# EAGLE design Diff_PressureSensor_SDP_v1.1_mrt2022 (EAGLE 9.6.2)
COMPANY: Adafruit Industries; DRAWN: KTOWN; REV: A
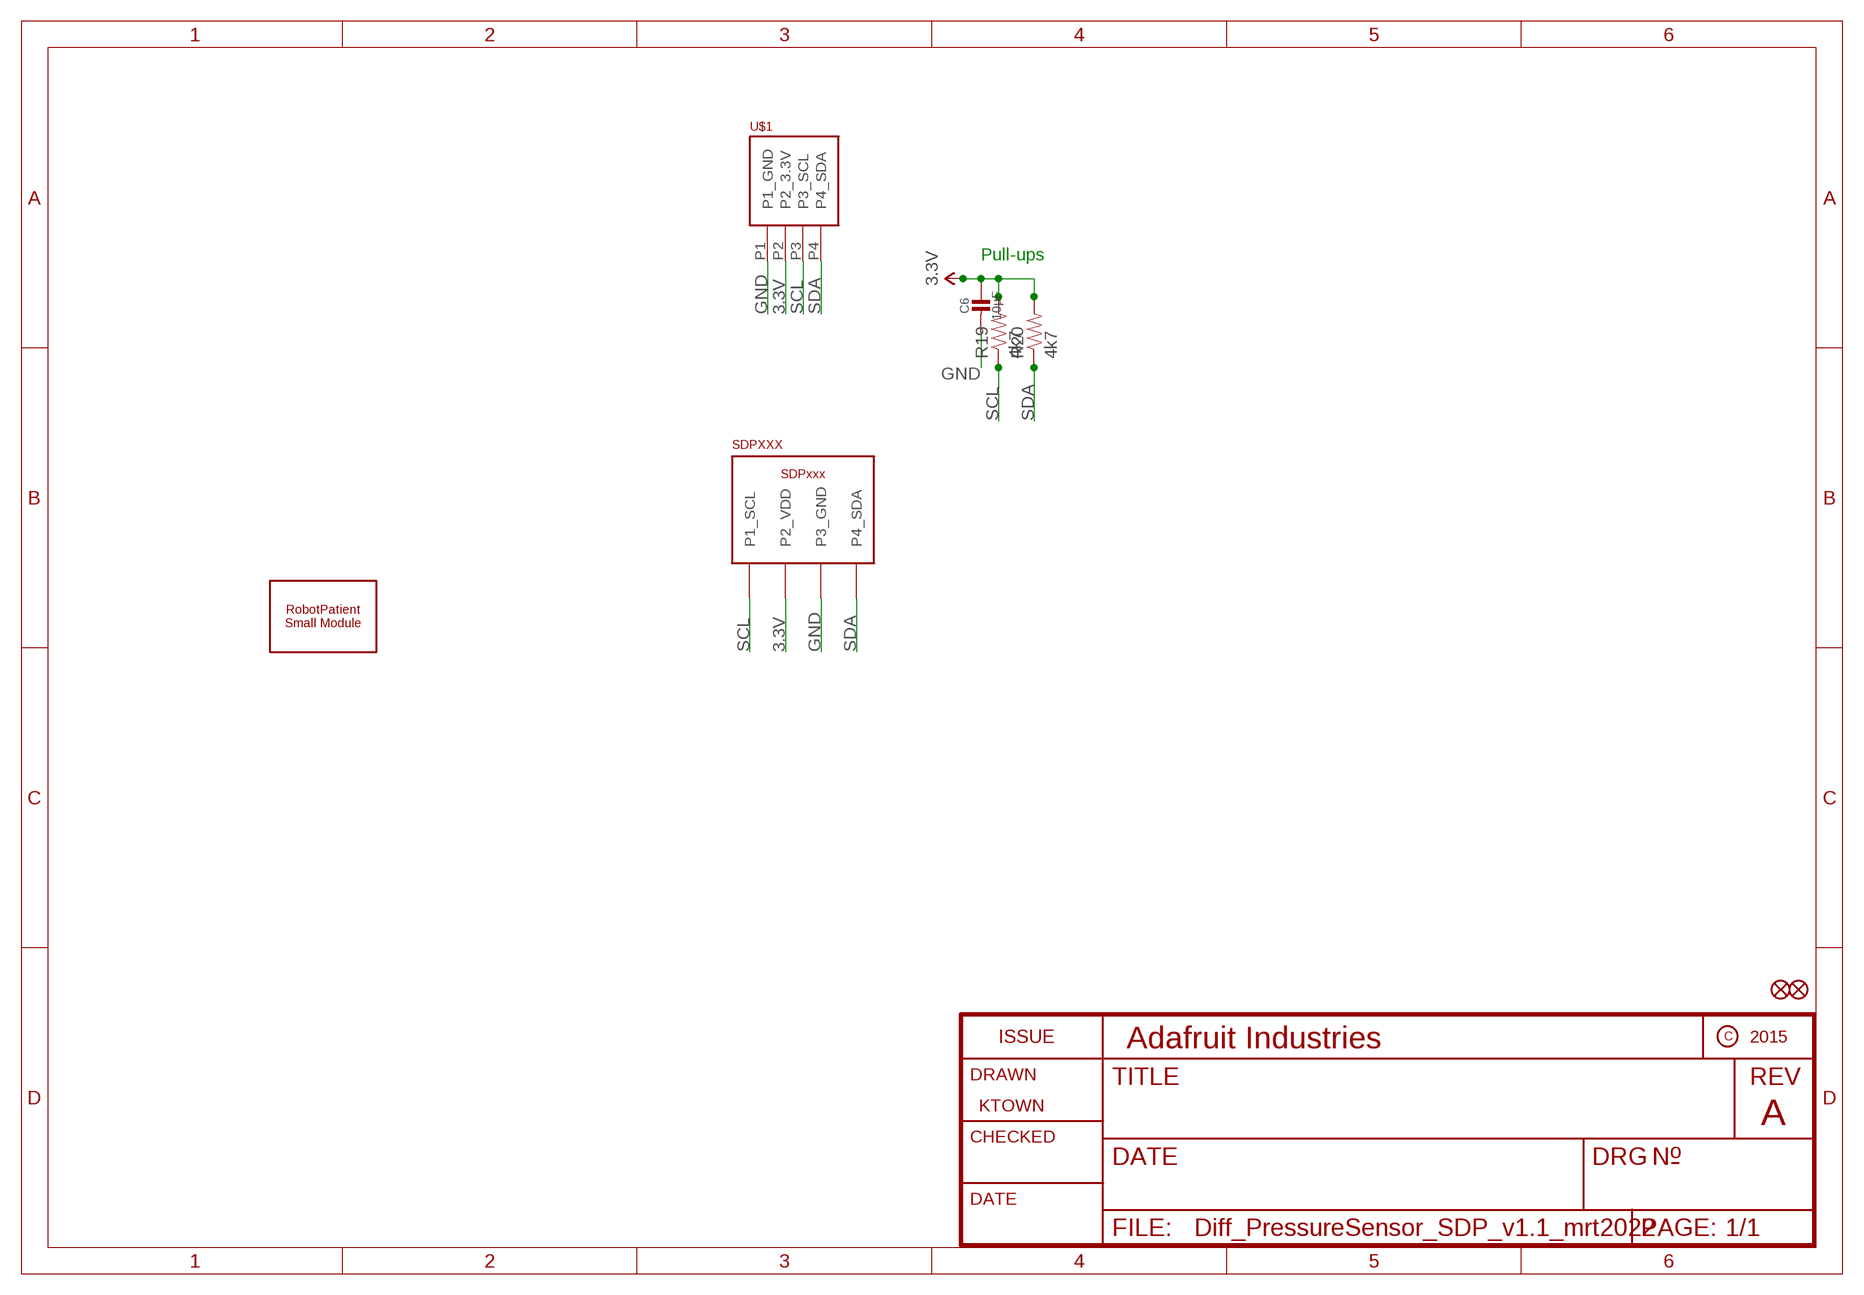
[diagram p0: schematic, sheet 1]

## Parts
C6  10µF  CAP_CERAMIC0805-NOOUTLINE  [0805-NO]
FID1  FIDUCIAL""  [FIDUCIAL_1MM]
FID2  FIDUCIAL""  [FIDUCIAL_1MM]
R19  4k7  47KOHM1/10W1%(0603)  [0603-RES]
R20  4k7  47KOHM1/10W1%(0603)  [0603-RES]
SDP810  SDPXXX  [SDPXXX]
U$1  PHOENIX_PTSM_M4_THANGLE  [PTSM_M4_TH]
U$2  ROBOTPATIENT_SMALL_MODULEBOARD  [RP_SMALL_SENSOR_OUTLINE]

## Nets
3.3V: C6.1 R19.2 R20.2 SDP810.P3_VCC(P2_VDD) U$1.P2(P2_3.3V)
GND: C6.2 SDP810.P2_GND(P3_GND) U$1.P1(P1_GND)
SCL: R19.1 SDP810.P4_CLK(P1_SCL) U$1.P3(P3_SCL)
SDA: R20.1 SDP810.P1_SDA(P4_SDA) U$1.P4(P4_SDA)

## Notes on the sheet
- Pull-ups

## Library data of the parts
C6 = microbuilder:CAP_CERAMIC: Ceramic Capacitors For new designs, use the packages preceded by an '_' character since they are more reliable: The following footprints should be used on most boards: _0402 - Standard footprint for regular board layouts _0603 - Standard footprint for regular board layouts _0805 - Standard footprint for regular board layouts _1206 - Standard footprint for regular board layouts For extremely tight-pitch boards where space is at a premium, the following 'micro-pitch' footprints can be used (smaller pads, no silkscreen outline, etc.): _0402MP - Micro-pitch footprint for very dense/compact boards _0603MP - Micro-pitch footprint for very dense/compact boards _0805MP - Micro-pitch footprint for very dense/compact boards _1206MP - Micro-pitch footprint for very dense/compact boards
FID1 FID2 = microbuilder:FIDUCIAL: Fiducial Alignment Points Various fiducial points for machine vision alignment.; BOM: EXCLUDE
R19 R20 = SparkFun-Resistors:47KOHM1/10W1%(0603): RES-07871; PROD_ID: RES-07871; VALUE: 47K
SDP810 = jk_customs:SDPXXX: Sensirion SDPxxx (e.g. SDP81x) March 2022
U$1 = jk_customs:PHOENIX_PTSM_M4_TH
U$2 = jk_customs:ROBOTPATIENT_SMALL_MODULE

## Net classes
1 power: width 0.305 mm
2 gnd: width 0.254 mm

## Board
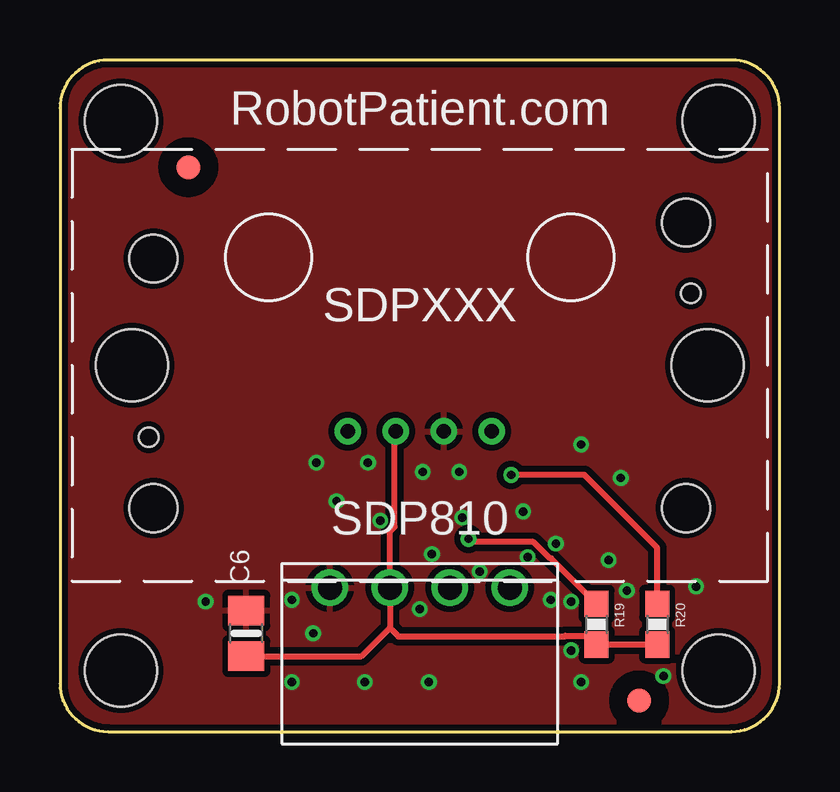
[diagram p1: board, top side]
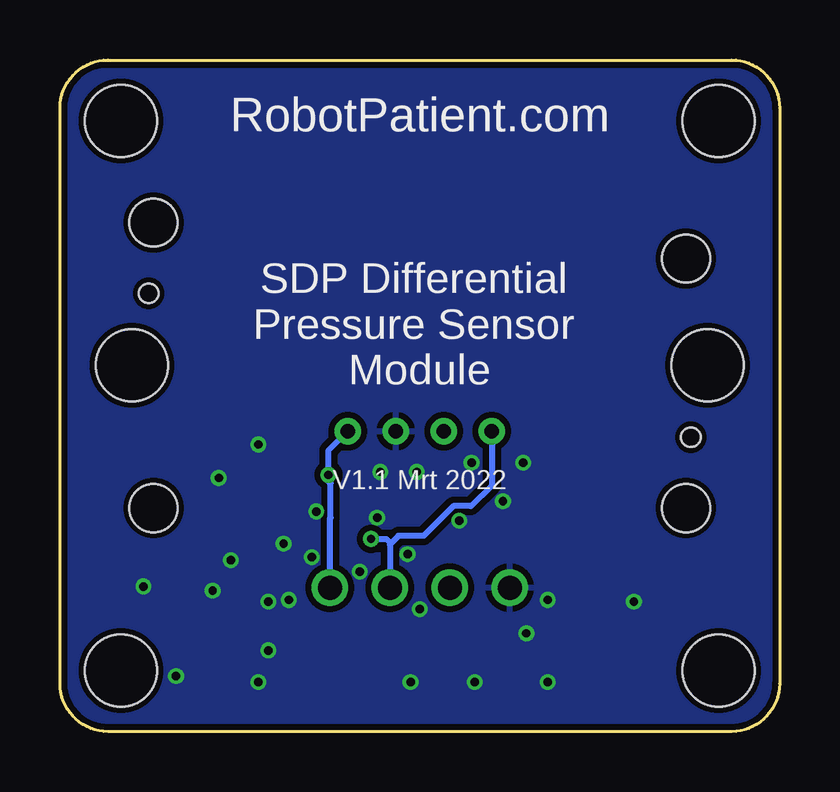
[diagram p2: board, bottom side, seen from below]

Size 30 x 28 mm. Coordinates in mm from the lower left corner, seen from the top.
Copper layers (1*16): Top 0.035mm / dielectric 1.5mm / Bottom 0.035mm
Design rules "SeeedStudio_2layer_DRU_no_angle_20140221": minimum track width 6mil, minimum drill 12mil, track to track 6mil, track to pad 6mil, pad to pad 6mil, via to via 6mil, smd to smd 0mil, copper to edge 10mil, drill to drill 10mil, minimum pad ring 10mil, minimum via ring 6mil, stop-mask expansion 2mil, vias tented up to drill 100mil, thermal gap 10mil

### Footprints (pad centres in the part's own frame; a part is rotated, then mirrored left to right if it is on the bottom)
0805-NO = smd 1.24 x 1.5: 1 -0.95,0; 2 0.95,0
FIDUCIAL_1MM = smd 1 x 1: 1 0,0
0603-RES = smd 1.1 x 1: 1 -0.85,0; 2 0.85,0
SDPXXX = drill 0.6: P1_SDA 3,-2.75; P2_GND 1,-2.75; P3_VCC -1,-2.75; P4_CLK -3,-2.75 | hole 3: 12,0; -12,0 | hole 2: 11.1,5.95; 11.1,-5.95; -11.1,4.45; -11.1,-5.95 | hole 0.8: -11.3,-3; 11.3,3
PTSM_M4_TH = drill 1: P1 3.75,1; P2 1.25,1; P3 -1.25,1; P4 -3.75,1
RP_SMALL_SENSOR_OUTLINE = hole 3: -11.455,12.455; 11.455,12.455; 11.455,-12.455; -11.455,-12.455

### Placement (x,y rotation side)
C6  7.76,4.09 90 top
FID1  5.35,23.53 0 top
FID2  24.14,1.3 0 top
R19  22.37,4.47 270 top
R20  24.91,4.47 270 top
SDP810  15,15.27 0 top
U$1  15,7 180 top
U$2  15,14 90 top

### Tracks (layer width: path | path; a pad name or v marks a point on that pad's centre or on a via)
3.3V
  Top 0.254: SDP810.P3_VCC 13.96,12.48 13.96,8.54 13.75,8.34 U$1.P2 13.75,4.33 | 13.75,4.33 14.11,3.97 21.04,3.97 21.06,3.99 22,3.99 R19.2 R20.2 | 13.75,4.33 12.57,3.14 C6.1
GND  (via drill 0.35)
  other vias: 16.65,10.82 13.35,8.79 9.67,5.49 9.67,2.06 16.78,8.92 19.32,9.17 21.73,11.97 23.38,10.57 23.64,5.87 20.46,5.49 17.5,6.67 15,5.11 15.51,7.4 15.38,2.06 19.5,7.27 20.68,7.83 21.31,5.41 21.31,3.38 25.16,2.32 26.52,6.05 11.53,9.61 6.07,5.41 21.73,2.06 22.87,7.14 15.13,10.82 12.84,11.21 10.68,11.21 10.55,4.09 12.71,2.06
  pour Top (isolate 0.254): -2.78,-2.89 -2.78,31.02 31.38,31.02 31.38,-2.89
  pour Bottom (isolate 0.254): -1,-3.4 -1,29.37 32.02,29.37 32.02,-3.4
SCL  (via drill 0.35)
  Top 0.254: R19.1 20.47,7.22 20.43,7.22 19.74,7.9 17.16,7.9 v17.03,8.03
  Bottom 0.254: SDP810.P4_CLK 12,10.27 12.87,9.4 13.6,9.4 14.84,8.16 15.89,8.16 16.21,7.84 | 16.21,7.84 16.25,7.8 U$1.P3 | v17.03,8.03 16.4,8.03 16.21,7.84
SDA  (via drill 0.35)
  Top 0.254: R20.1 24.91,7.65 21.86,10.7 v18.81,10.7
  Bottom 0.254: U$1.P4 18.75,8.88 18.71,8.92 18.71,10.35 18.81,10.44 v18.81,10.7 18.81,11.71 SDP810.P1_SDA

### Text on the board
tSilk: RobotPatient.com
bSilk: RobotPatient.com | SDP Differential / Pressure Sensor / Module